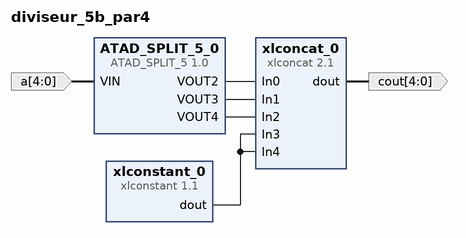
[diagram p0: block diagram of the top level]
# Vivado block design diviseur_5b_par4, xc7a100tcsg324-1, Vivado 2018.3
create_bd_design diviseur_5b_par4

create_bd_port -dir I -from 4 -to 0 a
create_bd_port -dir O -from 4 -to 0 cout

create_bd_cell -type ip -vlnv xilinx.com:user:ATAD_SPLIT_5:1.0 ATAD_SPLIT_5_0
create_bd_cell -type ip -vlnv xilinx.com:ip:xlconstant:1.1 xlconstant_0
set_property -dict {CONFIG.CONST_VAL 0} [get_bd_cells xlconstant_0]
create_bd_cell -type ip -vlnv xilinx.com:ip:xlconcat:2.1 xlconcat_0
set_property -dict {CONFIG.NUM_PORTS 5} [get_bd_cells xlconcat_0]

# ---- connections ----

connect_bd_net [get_bd_ports a] [get_bd_pins ATAD_SPLIT_5_0/VIN]
connect_bd_net [get_bd_pins ATAD_SPLIT_5_0/VOUT2] [get_bd_pins xlconcat_0/In0]
connect_bd_net [get_bd_pins ATAD_SPLIT_5_0/VOUT3] [get_bd_pins xlconcat_0/In1]
connect_bd_net [get_bd_pins ATAD_SPLIT_5_0/VOUT4] [get_bd_pins xlconcat_0/In2]
connect_bd_net [get_bd_pins xlconstant_0/dout] [get_bd_pins xlconcat_0/In3] [get_bd_pins xlconcat_0/In4]
connect_bd_net [get_bd_pins xlconcat_0/dout] [get_bd_ports cout]

validate_bd_design
save_bd_design
